# EAGLE design basic-inline-turbidimeter_reed_board_v1 (EAGLE 7.7.0)
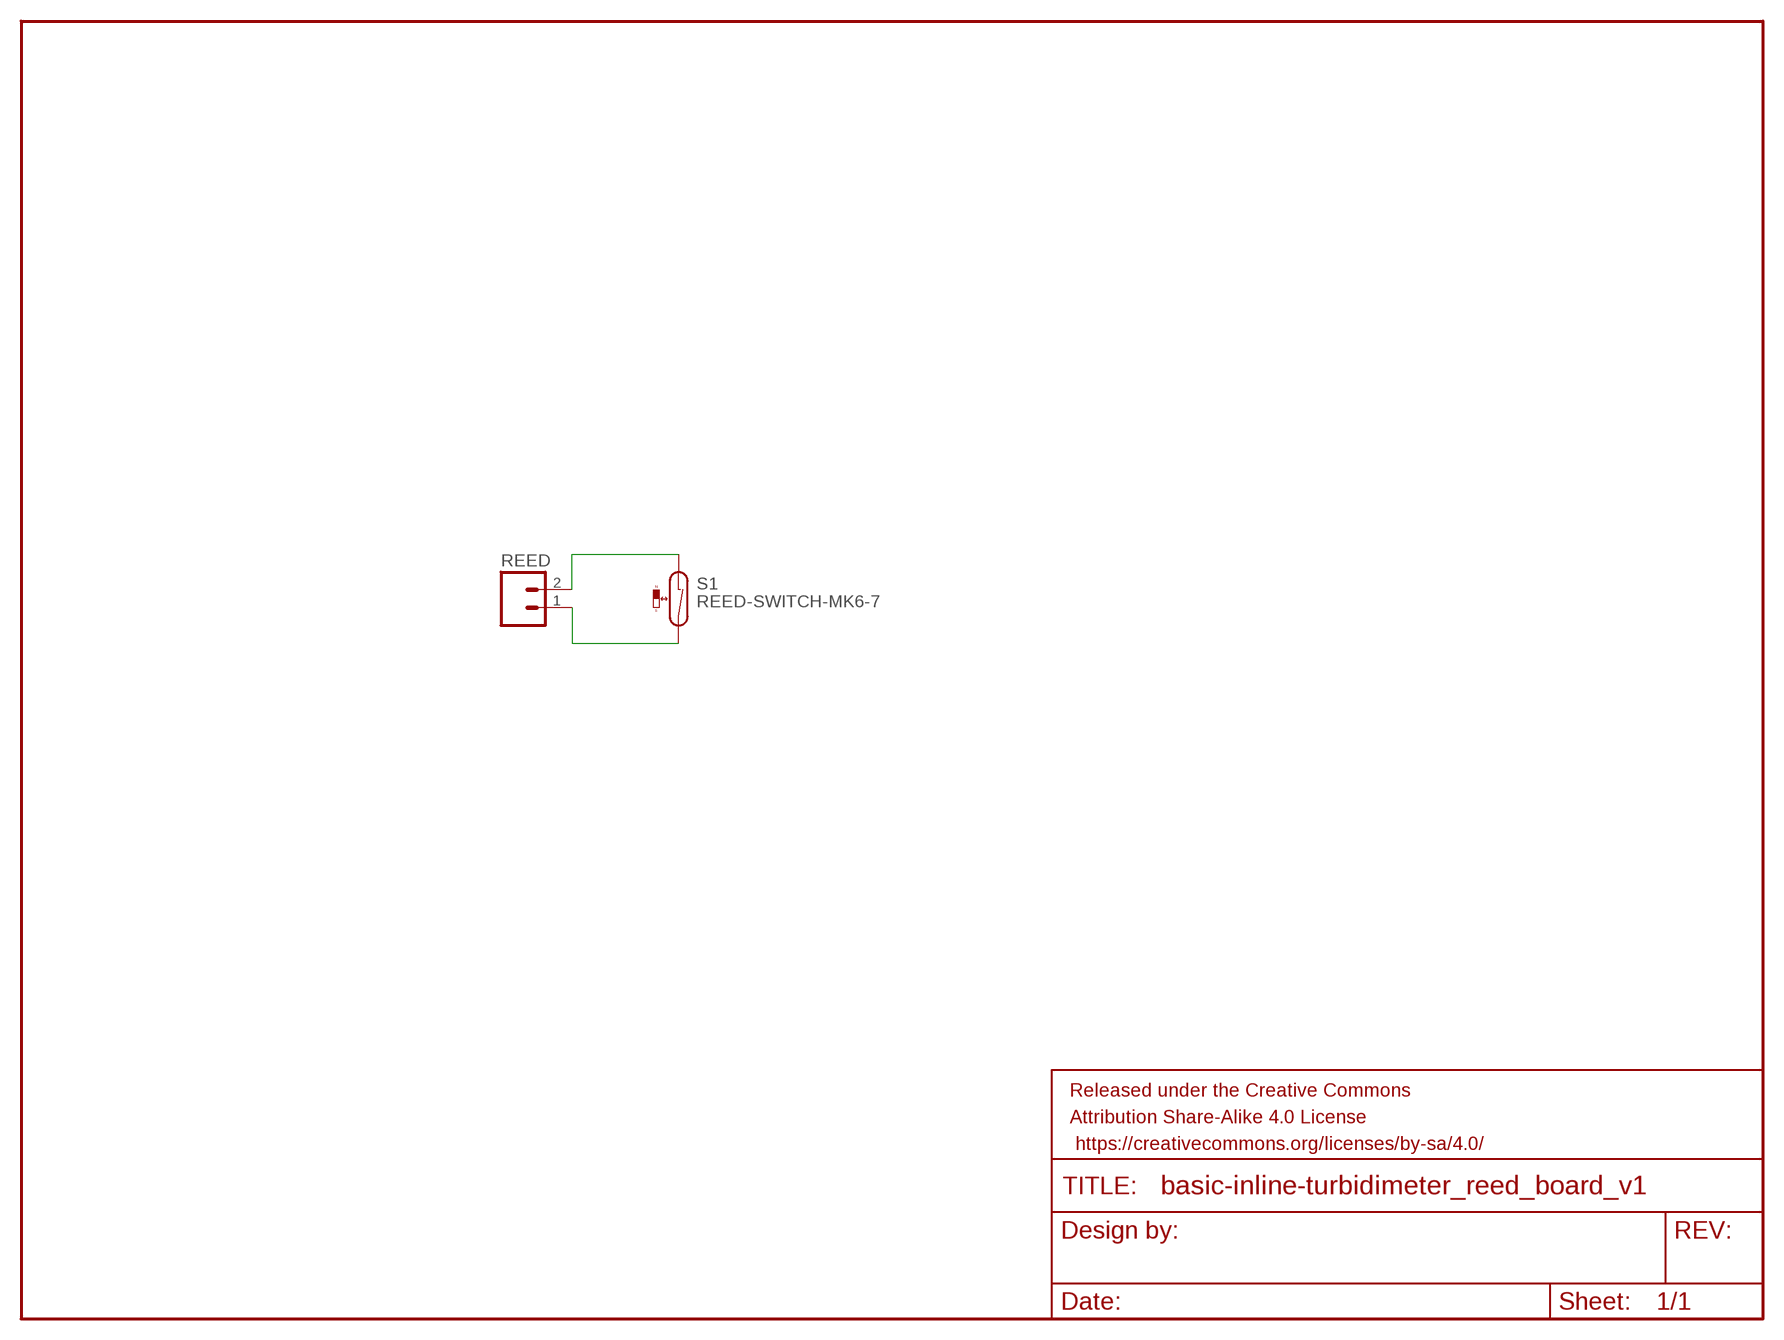
[diagram p0: schematic, sheet 1]

## Parts
FRAME1  FRAME-LETTER  [CREATIVE_COMMONS]
REED  M02PTH  [1X02]
S1  REED-SWITCH-MK6-7  [MK6-7]

## Nets
N$1: REED.2 S1.1
N$2: REED.1 S1.2

## Library data of the parts
FRAME1 = SparkFun-Aesthetics:FRAME-LETTER: Schematic Frame Standard 8.5x11 US Letter frame
REED = SparkFun-Connectors:M02: Standard 2-pin 0.1" header. Use with - straight break away headers ( PRT-00116) - right angle break away headers (PRT-00553) - swiss pins (PRT-00743) - machine pins (PRT-00117) - female headers (PRT-00115) Molex polarized connector foot print use with: PRT-08233 with associated crimp pins and housings. 2.54_SCREWTERM for use with PRT-10571. 3.5mm Screw Terminal footprints for PRT-08084 5mm Screw Terminal footprints for use with PRT-08432
S1 = switch-reed:REED-SWITCH-: Reed Sensor; OC_FARNELL: unknown

## Board
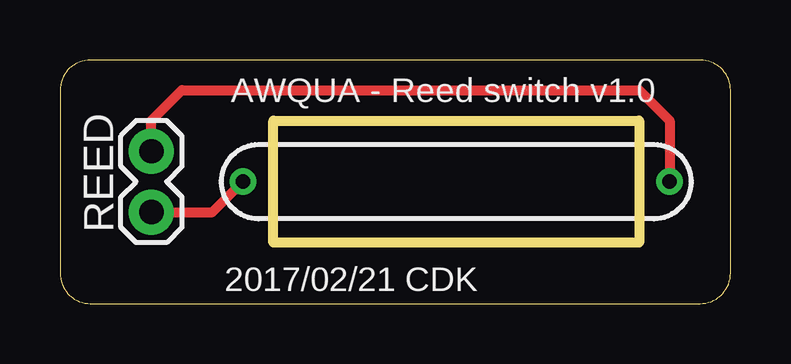
[diagram p1: board, top side]

Size 27.94 x 10.15 mm. Coordinates in mm from the lower left corner, seen from the top.
Outline: 0,8.88 0,1.27 arc90 1.27,0 26.67,0 arc90 27.94,1.27 27.94,8.89 arc90 26.68,10.15 1.27,10.15 arc90 0,8.88
Outline: 8.89,7.62 24.13,7.62 24.13,2.54 8.89,2.54 8.89,7.62
Copper layers (1*16): Top 0.035mm / dielectric 1.5mm / Bottom 0.035mm
Design rules "default": minimum track width 10mil, minimum drill 24mil, track to track 8mil, track to pad 8mil, pad to pad 8mil, via to via 8mil, smd to smd 8mil, copper to edge 40mil, drill to drill 8mil, minimum pad ring 10mil, minimum via ring 8mil, stop-mask expansion 4mil, vias tented up to drill 0mil, thermal gap 10mil

### Footprints (pad centres in the part's own frame; a part is rotated, then mirrored left to right if it is on the bottom)
1X02 = drill 1.016 pad 1.88: 1 0,0; 2 2.54,0
MK6-7 = drill 0.6 pad 1.016: 1 -8.89,0; 2 8.89,0

### Placement (x,y rotation side)
FRAME1  -3.81,-12.7 0 top  (outside the outline)
REED  3.81,6.35 270 top
S1  16.51,5.08 0 top

### Tracks (layer width: path | path; a pad name or v marks a point on that pad's centre or on a via)
N$1
  Top 0.406: REED.2 6.35,3.81 S1.1
N$2
  Top 0.406: REED.1 3.81,7.62 5.08,8.89 24.13,8.89 25.4,7.62 S1.2

### Text on the board
tNames: AWQUA - Reed switch v1.0 | 2017/02/21 CDK